# Altium schematic sheet Sheet1.SchDoc
size A2; SheetNumber: 2; SheetTotal: 1
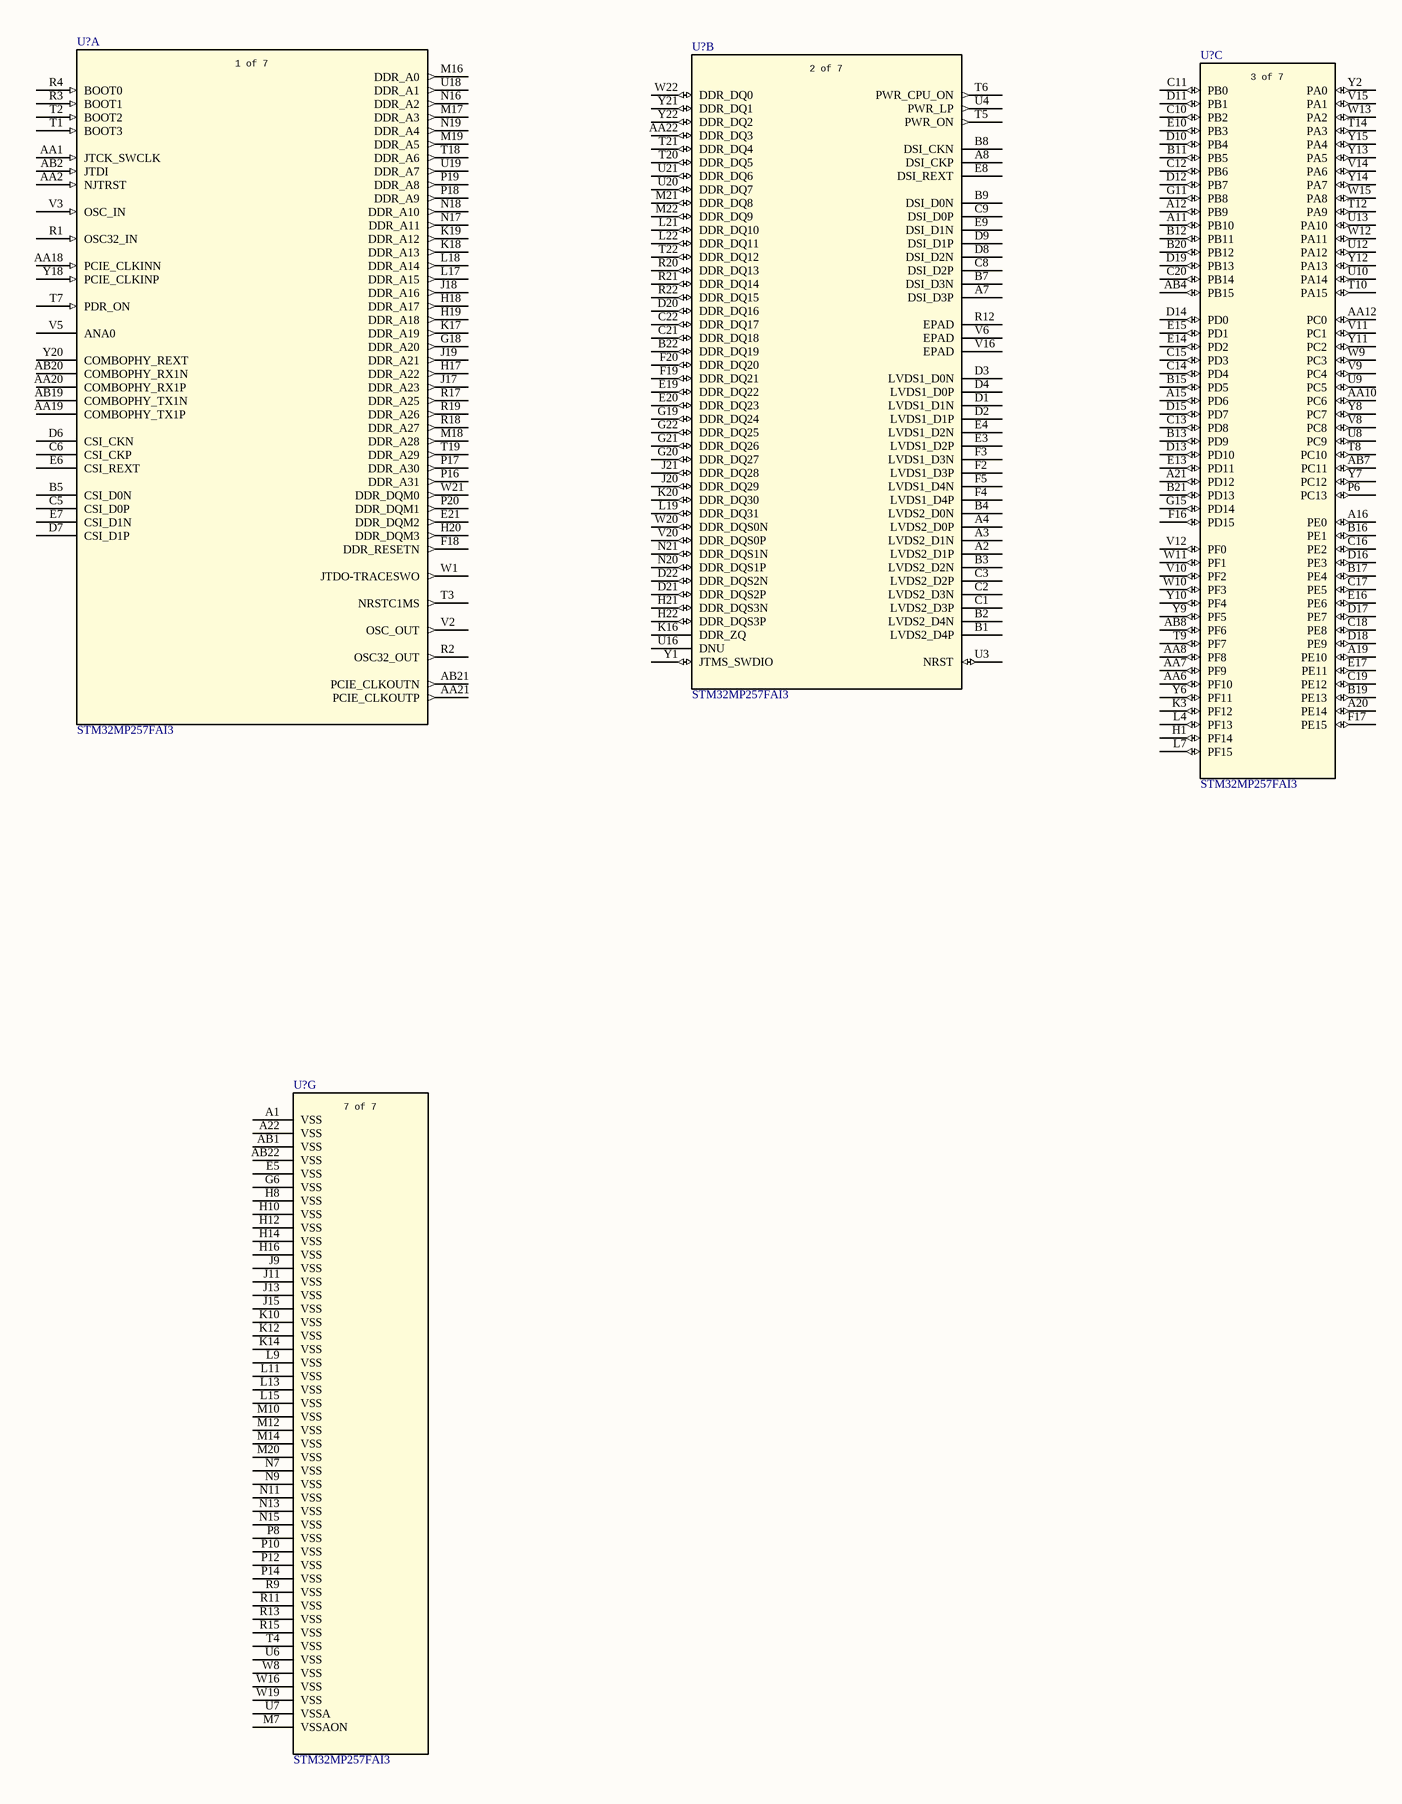
[diagram p0: Sheet1.SchDoc, left]
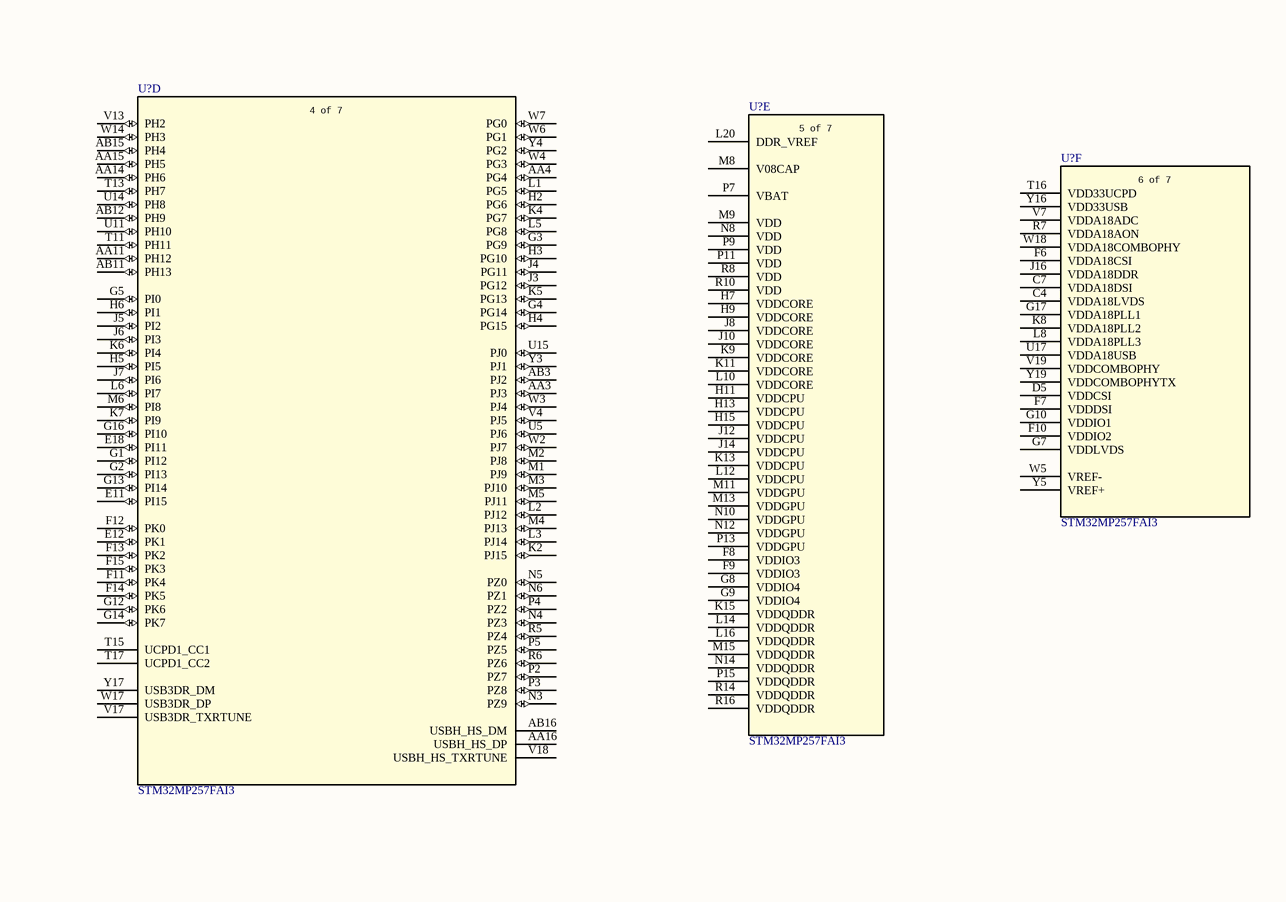
[diagram p1: Sheet1.SchDoc, right]

## Parts
(Parts that share a designator on the sheet are numbered #1, #2 ... from top to bottom, then left to right.)
U?#1  STM32MP257FAI3  [TFBGA436_STM]  (part A of 7)
U?#2  STM32MP257FAI3  [TFBGA436_STM]  (part C of 7)
U?#3  STM32MP257FAI3  [TFBGA436_STM]  (part B of 7)
U?#4  STM32MP257FAI3  [TFBGA436_STM]  (part D of 7)
U?#5  STM32MP257FAI3  [TFBGA436_STM]  (part E of 7)
U?#6  STM32MP257FAI3  [TFBGA436_STM]  (part F of 7)
U?#7  STM32MP257FAI3  [TFBGA436_STM]  (part G of 7)

## Nets

Not connected (* = marked no-connect by the designer): U?#1 AA1(JTCK_SWCLK) AA2(NJTRST) AA18(PCIE_CLKINN) AA19(COMBOPHY_TX1P) AA20(COMBOPHY_RX1P) AA21(PCIE_CLKOUTP) AB2(JTDI) AB19(COMBOPHY_TX1N) AB20(COMBOPHY_RX1N) AB21(PCIE_CLKOUTN) B5(CSI_D0N) C5(CSI_D0P) C6(CSI_CKP) D6(CSI_CKN) D7(CSI_D1P) E6(CSI_REXT) E7(CSI_D1N) E21(DDR_DQM2) F18(DDR_RESETN) G18(DDR_A20) H17(DDR_A22) H18(DDR_A17) H19(DDR_A18) H20(DDR_DQM3) J17(DDR_A23) J18(DDR_A16) J19(DDR_A21) K17(DDR_A19) K18(DDR_A13) K19(DDR_A12) L17(DDR_A15) L18(DDR_A14) M16(DDR_A0) M17(DDR_A3) M18(DDR_A28) M19(DDR_A5) N16(DDR_A2) N17(DDR_A11) N18(DDR_A10) N19(DDR_A4) P16(DDR_A31) P17(DDR_A30) P18(DDR_A9) P19(DDR_A8) P20(DDR_DQM1) R1(OSC32_IN) R2(OSC32_OUT) R3(BOOT1) R4(BOOT0) R17(DDR_A25) R18(DDR_A27) R19(DDR_A26) T1(BOOT3) T2(BOOT2) T3(NRSTC1MS) T7(PDR_ON) T18(DDR_A6) T19(DDR_A29) U18(DDR_A1) U19(DDR_A7) V2(OSC_OUT) V3(OSC_IN) V5(ANA0) W1(JTDO-TRACESWO) W21(DDR_DQM0) Y18(PCIE_CLKINP) Y20(COMBOPHY_REXT); U?#2 A11(PB10) A12(PB9) A15(PD6) A16(PE0) A19(PE10) A20(PE14) A21(PD12) AA6(PF10) AA7(PF9) AA8(PF8) AA10(PC6) AA12(PC0) AB4(PB15) AB7(PC11) AB8(PF6) B11(PB5) B12(PB11) B13(PD9) B15(PD5) B16(PE1) B17(PE4) B19(PE13) B20(PB12) B21(PD13) C10(PB2) C11(PB0) C12(PB6) C13(PD8) C14(PD4) C15(PD3) C16(PE2) C17(PE5) C18(PE8) C19(PE12) C20(PB14) D10(PB4) D11(PB1) D12(PB7) D13(PD10) D14(PD0) D15(PD7) D16(PE3) D17(PE7) D18(PE9) D19(PB13) E10(PB3) E13(PD11) E14(PD2) E15(PD1) E16(PE6) E17(PE11) F16(PD15) F17(PE15) G11(PB8) G15(PD14) H1(PF14) K3(PF12) L4(PF13) L7(PF15) P6(PC13) T8(PC10) T9(PF7) T10(PA15) T12(PA9) T14(PA3) U8(PC9) U9(PC5) U10(PA14) U12(PA12) U13(PA10) V8(PC8) V9(PC4) V10(PF2) V11(PC1) V12(PF0) V14(PA6) V15(PA1) W9(PC3) W10(PF3) W11(PF1) W12(PA11) W13(PA2) W15(PA8) Y2(PA0) Y6(PF11) Y7(PC12) Y8(PC7) Y9(PF5) Y10(PF4) Y11(PC2) Y12(PA13) Y13(PA5) Y14(PA7) Y15(PA4); U?#3 A2(LVDS2_D1P) A3(LVDS2_D1N) A4(LVDS2_D0P) A7(DSI_D3P) A8(DSI_CKP) AA22(DDR_DQ3) B1(LVDS2_D4P) B2(LVDS2_D4N) B3(LVDS2_D2N) B4(LVDS2_D0N) B7(DSI_D3N) B8(DSI_CKN) B9(DSI_D0N) B22(DDR_DQ19) C1(LVDS2_D3P) C2(LVDS2_D3N) C3(LVDS2_D2P) C8(DSI_D2P) C9(DSI_D0P) C21(DDR_DQ18) C22(DDR_DQ17) D1(LVDS1_D1N) D2(LVDS1_D1P) D3(LVDS1_D0N) D4(LVDS1_D0P) D8(DSI_D2N) D9(DSI_D1P) D20(DDR_DQ16) D21(DDR_DQS2P) D22(DDR_DQS2N) E3(LVDS1_D2P) E4(LVDS1_D2N) E8(DSI_REXT) E9(DSI_D1N) E19(DDR_DQ22) E20(DDR_DQ23) F2(LVDS1_D3P) F3(LVDS1_D3N) F4(LVDS1_D4P) F5(LVDS1_D4N) F19(DDR_DQ21) F20(DDR_DQ20) G19(DDR_DQ24) G20(DDR_DQ27) G21(DDR_DQ26) G22(DDR_DQ25) H21(DDR_DQS3N) H22(DDR_DQS3P) J20(DDR_DQ29) J21(DDR_DQ28) K16(DDR_ZQ) K20(DDR_DQ30) L19(DDR_DQ31) L21(DDR_DQ10) L22(DDR_DQ11) M21(DDR_DQ8) M22(DDR_DQ9) N20(DDR_DQS1P) N21(DDR_DQS1N) R12(EPAD) R20(DDR_DQ13) R21(DDR_DQ14) R22(DDR_DQ15) T5(PWR_ON) T6(PWR_CPU_ON) T20(DDR_DQ5) T21(DDR_DQ4) T22(DDR_DQ12) U3(NRST) U4(PWR_LP) U16(DNU) U20(DDR_DQ7) U21(DDR_DQ6) V6(EPAD) V16(EPAD) V20(DDR_DQS0P) W20(DDR_DQS0N) W22(DDR_DQ0) Y1(JTMS_SWDIO) Y21(DDR_DQ1) Y22(DDR_DQ2); U?#4 AA3(PJ3) AA4(PG4) AA11(PH12) AA14(PH6) AA15(PH5) AA16(USBH_HS_DP) AB3(PJ2) AB11(PH13) AB12(PH9) AB15(PH4) AB16(USBH_HS_DM) E11(PI15) E12(PK1) E18(PI11) F11(PK4) F12(PK0) F13(PK2) F14(PK5) F15(PK3) G1(PI12) G2(PI13) G3(PG9) G4(PG14) G5(PI0) G12(PK6) G13(PI14) G14(PK7) G16(PI10) H2(PG6) H3(PG10) H4(PG15) H5(PI5) H6(PI1) J3(PG12) J4(PG11) J5(PI2) J6(PI3) J7(PI6) K2(PJ15) K4(PG7) K5(PG13) K6(PI4) K7(PI9) L1(PG5) L2(PJ12) L3(PJ14) L5(PG8) L6(PI7) M1(PJ9) M2(PJ8) M3(PJ10) M4(PJ13) M5(PJ11) M6(PI8) N3(PZ9) N4(PZ3) N5(PZ0) N6(PZ1) P2(PZ7) P3(PZ8) P4(PZ2) P5(PZ5) R5(PZ4) R6(PZ6) T11(PH11) T13(PH7) T15(UCPD1_CC1) T17(UCPD1_CC2) U5(PJ6) U11(PH10) U14(PH8) U15(PJ0) V4(PJ5) V13(PH2) V17(USB3DR_TXRTUNE) V18(USBH_HS_TXRTUNE) W2(PJ7) W3(PJ4) W4(PG3) W6(PG1) W7(PG0) W14(PH3) W17(USB3DR_DP) Y3(PJ1) Y4(PG2) Y17(USB3DR_DM); U?#5 F8(VDDIO3) F9(VDDIO3) G8(VDDIO4) G9(VDDIO4) H7(VDDCORE) H9(VDDCORE) H11(VDDCPU) H13(VDDCPU) H15(VDDCPU) J8(VDDCORE) J10(VDDCORE) J12(VDDCPU) J14(VDDCPU) K9(VDDCORE) K11(VDDCORE) K13(VDDCPU) K15(VDDQDDR) L10(VDDCORE) L12(VDDCPU) L14(VDDQDDR) L16(VDDQDDR) L20(DDR_VREF) M8(V08CAP) M9(VDD) M11(VDDGPU) M13(VDDGPU) M15(VDDQDDR) N8(VDD) N10(VDDGPU) N12(VDDGPU) N14(VDDQDDR) P7(VBAT) P9(VDD) P11(VDD) P13(VDDGPU) P15(VDDQDDR) R8(VDD) R10(VDD) R14(VDDQDDR) R16(VDDQDDR); U?#6 C4(VDDA18LVDS) C7(VDDA18DSI) D5(VDDCSI) F6(VDDA18CSI) F7(VDDDSI) F10(VDDIO2) G7(VDDLVDS) G10(VDDIO1) G17(VDDA18PLL1) J16(VDDA18DDR) K8(VDDA18PLL2) L8(VDDA18PLL3) R7(VDDA18AON) T16(VDD33UCPD) U17(VDDA18USB) V7(VDDA18ADC) V19(VDDCOMBOPHY) W5(VREF-) W18(VDDA18COMBOPHY) Y5(VREF+) Y16(VDD33USB) Y19(VDDCOMBOPHYTX); U?#7 A1(VSS) A22(VSS) AB1(VSS) AB22(VSS) E5(VSS) G6(VSS) H8(VSS) H10(VSS) H12(VSS) H14(VSS) H16(VSS) J9(VSS) J11(VSS) J13(VSS) J15(VSS) K10(VSS) K12(VSS) K14(VSS) L9(VSS) L11(VSS) L13(VSS) L15(VSS) M7(VSSAON) M10(VSS) M12(VSS) M14(VSS) M20(VSS) N7(VSS) N9(VSS) N11(VSS) N13(VSS) N15(VSS) P8(VSS) P10(VSS) P12(VSS) P14(VSS) R9(VSS) R11(VSS) R13(VSS) R15(VSS) T4(VSS) U6(VSS) U7(VSSA) W8(VSS) W16(VSS) W19(VSS)

## Notes on the sheet
- (in symbol STM32MP257FAI3, part A) 1 of 7
- (in symbol STM32MP257FAI3, part B) 2 of 7
- (in symbol STM32MP257FAI3, part C) 3 of 7
- (in symbol STM32MP257FAI3, part D) 4 of 7
- (in symbol STM32MP257FAI3, part E) 5 of 7
- (in symbol STM32MP257FAI3, part F) 6 of 7
- (in symbol STM32MP257FAI3, part G) 7 of 7

## Library data of the parts
U?#1-U?#7 = STM32MP257FAI3: MPU with Dual Arm Cortex-A35 @1.5GHz, Cortex-M33 @400MHz, 3xEthernet (2+1 switch), 3xFD-CAN, LVDS/DSI, H.264, 3D GPU, AI/NN, Secure Boot, Cryptography, DRAM enc/dec, PKA; Manufacturer_Name: STMicroelectronics; Copyright: Copyright (C) 2025 Ultra Librarian. All rights reserved.; Manufacturer_Part_Number: STM32MP257FAI3; RefDes: RefDes; Type: Type